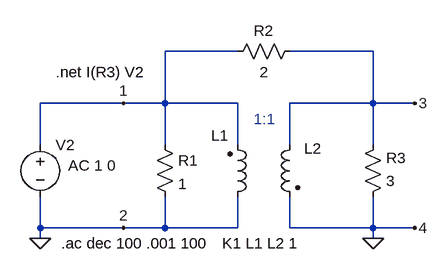
[diagram p0: schematic TS6_Albanesi_SimulacionCircuitalPunto1.asc]
TS6_Albanesi_SimulacionCircuitalPunto1.asc, the LTspice schematic file:
Version 4
SHEET 1 880 1328
WIRE 304 384 192 384
WIRE 512 384 384 384
WIRE 128 464 0 464
WIRE 192 464 192 384
WIRE 192 464 128 464
WIRE 304 464 192 464
WIRE 512 464 512 384
WIRE 512 464 384 464
WIRE 576 464 512 464
WIRE 0 528 0 464
WIRE 192 528 192 464
WIRE 304 528 304 464
WIRE 384 528 384 464
WIRE 512 528 512 464
WIRE 0 656 0 608
WIRE 128 656 0 656
WIRE 192 656 192 608
WIRE 192 656 128 656
WIRE 304 656 304 608
WIRE 304 656 192 656
WIRE 384 656 384 608
WIRE 512 656 512 608
WIRE 512 656 384 656
WIRE 576 656 512 656
WIRE 0 672 0 656
WIRE 512 672 512 656
FLAG 0 672 0
FLAG 128 464 1
FLAG 128 656 2
FLAG 576 464 3
FLAG 576 656 4
FLAG 512 672 0
SYMBOL voltage 0 512 R0
WINDOW 3 24 96 Invisible 2
WINDOW 123 43 48 Left 2
SYMATTR Value 0
SYMATTR InstName V2
SYMATTR Value2 AC 1 0
SYMATTR SpiceLine Rser=0.0001
SYMBOL ind2 288 624 M180
WINDOW 0 -25 110 Left 2
WINDOW 3 -24 44 Invisible 2
SYMATTR InstName L1
SYMATTR Value 1000
SYMATTR Type ind
SYMBOL ind2 400 512 M0
WINDOW 0 -33 22 Left 2
WINDOW 3 -20 67 Invisible 2
SYMATTR InstName L2
SYMATTR Value 1000
SYMATTR Type ind
SYMBOL res 176 512 R0
SYMATTR InstName R1
SYMATTR Value 1
SYMBOL res 400 368 R90
WINDOW 0 0 56 VBottom 2
WINDOW 3 32 56 VTop 2
SYMATTR InstName R2
SYMATTR Value 2
SYMBOL res 496 624 M180
WINDOW 0 36 76 Left 2
WINDOW 3 36 40 Left 2
SYMATTR InstName R3
SYMATTR Value 3
TEXT 24 416 Left 2 !.net I(R3) V2
TEXT 280 680 Left 2 !K1 L1 L2 1
TEXT 32 680 Left 2 !.ac dec 100 .001 100
TEXT 328 488 Left 2 ;1:1

The netlist it stands for:
* TS6_Albanesi_SimulacionCircuitalPunto1.asc
V2 1 0 0 AC 1 0 Rser=0.0001
L1 0 1 1000
L2 3 0 1000
R1 1 0 1
R2 3 1 2
R3 0 3 3
.net I(R3) V2
K1 L1 L2 1
.ac dec 100 .001 100
* 1:1
.backanno
.end